# EAGLE schematic shema.v6 (EAGLE 7.6.0)
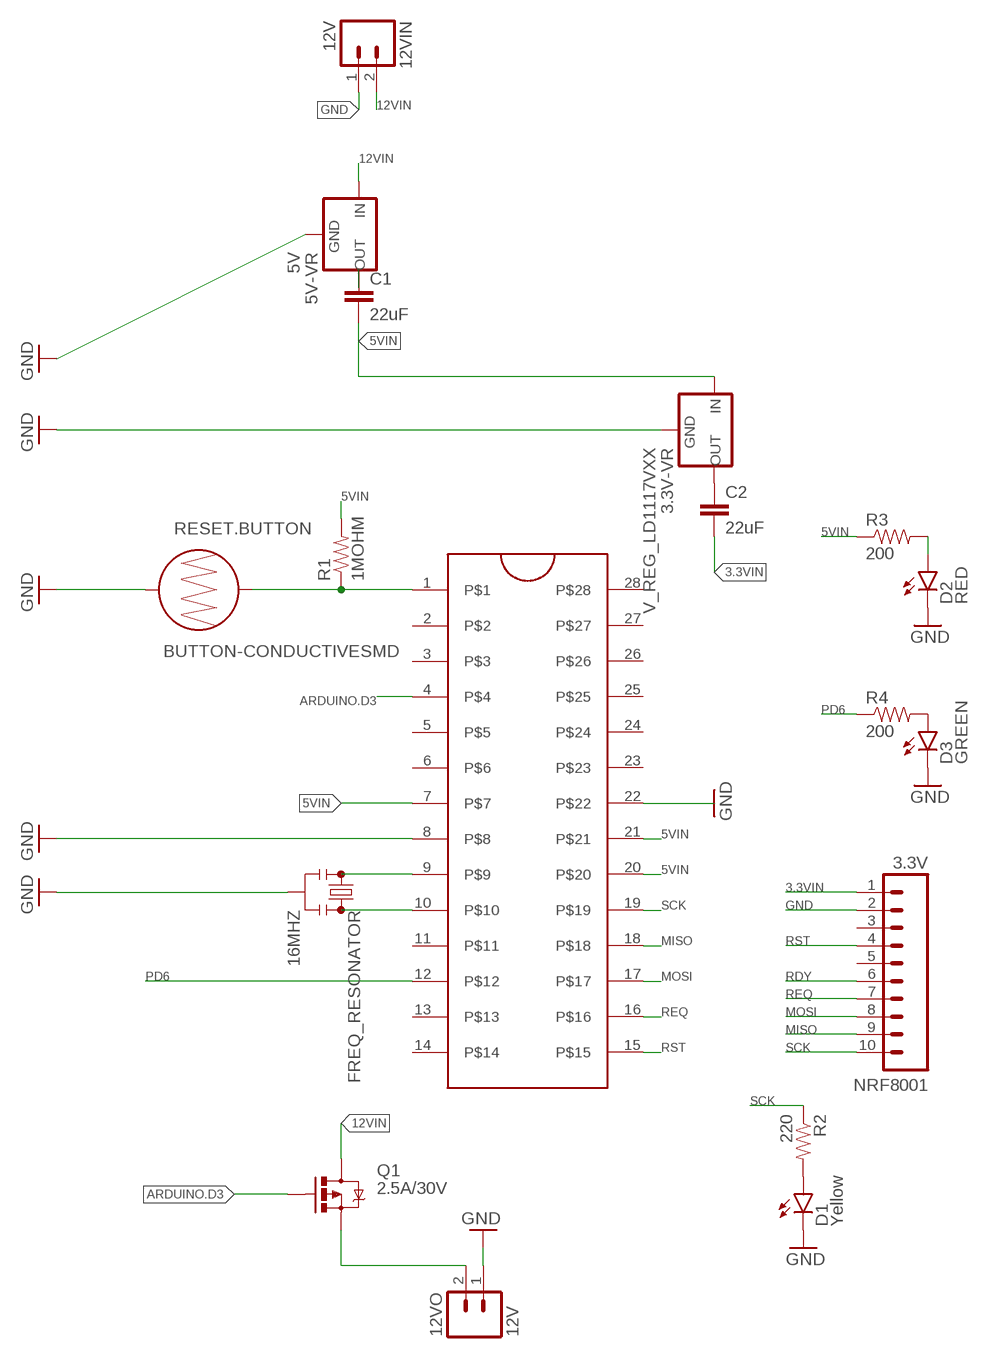
[diagram p0: schematic, sheet 1]

## Parts
3.3V-VR  V_REG_LD1117VXX  [78XXL]
5V-VR  5V  V_REG_78XX-TO-220  [TO-220-ALT]
12VIN  12V  M02JST-PTH-2  [JST-2-PTH]
12VO  12V  M02JST-PTH-2  [JST-2-PTH]
ATMEGA328  ZIFSOCKET-28-3ZIFFSOCKET-28-3  [DIL28-3-ZIF_SOCKET]
C1  22uF  22UF-16V-20%-(1210)  [1210]
C2  22uF  22UF-16V-20%-(1210)  [1210]
D1  Yellow  LED-YELLOW0603  [LED-0603]
D2  RED  LED-RED0603  [LED-0603]
D3  GREEN  LED-GREEN1206  [LED-1206]
FREQ_RESONATOR  16MHZ  RESONATOR16MHZ  [RESONATOR-SMD]
NRF8001  3.3V  M10SILK_FEMALE_PTH  [1X10]
Q1  2.5A/30V  MOSFET-PCHANNELDMG2307L  [SOT23-3]
R1  1MOHM  RESISTORPTH-1/6W  [1/6W-RES]
R2  220  100OHM-1/4W-1%(PTH)HORIZ-KIT  [AXIAL-0.3EZ]
R3  200  200OHM1/10W1%(0603)  [0603-RES]
R4  200  200OHM1/10W1%(0603)  [0603-RES]
RESET.BUTTON  BUTTON-CONDUCTIVESMD  [BUTTON-CONDUCTIVE]

## Nets
3.3VIN: C2.2 NRF8001.1
5VIN: 3.3V-VR.OUT(IN) ATMEGA328.7 ATMEGA328.20 ATMEGA328.21 C1.2 R1.2 R3.1
12VIN: 5V-VR.IN 12VIN.2 Q1.3(D)
ARDUINO.D3: ATMEGA328.4 Q1.1(G)
GND: 3.3V-VR.IN(GND) 5V-VR.GND 12VIN.1 12VO.1 ATMEGA328.8 D1.C D2.C D3.C FREQ_RESONATOR.2 NRF8001.2 RESET.BUTTON.1
MISO: ATMEGA328.18 NRF8001.9
MOSI: ATMEGA328.17 NRF8001.8
N$1: ATMEGA328.9 FREQ_RESONATOR.1
N$2: ATMEGA328.10 FREQ_RESONATOR.3
N$3: ATMEGA328.1 R1.1 RESET.BUTTON.2
N$4: 12VO.2 Q1.2(S)
N$5: 5V-VR.OUT C1.1
N$6: 3.3V-VR.GND(OUT) C2.1
N$7: D1.A R2.P$2
N$8: D2.A R3.2
N$9: ATMEGA328.22
N$10: D3.A R4.2
PD6: ATMEGA328.12 R4.1
RDY: NRF8001.6
REQ: ATMEGA328.16 NRF8001.7
RST: ATMEGA328.15 NRF8001.4
SCK: ATMEGA328.19 NRF8001.10 R2.P$1
Unconnected: ATMEGA328.2 ATMEGA328.3 ATMEGA328.5 ATMEGA328.6 ATMEGA328.11 ATMEGA328.13 ATMEGA328.14 ATMEGA328.23 ATMEGA328.24 ATMEGA328.25 ATMEGA328.26 ATMEGA328.27 ATMEGA328.28 NRF8001.3 NRF8001.5

## Library data of the parts
3.3V-VR = SparkFun-PowerIC:V_REG_LD1117VXX: LD1117VXX voltage regulator. We carry the 3.3V version (COM-00526) in TO-220 package.
5V-VR = SparkFun-PowerIC:V_REG_78XX: Voltage Regulator Standard 78xx regulator. IGO (Input Ground Output). Spark Fun Electronics SKU : COM-00107; PROD_ID: VREG-08450; SF_ID: COM-00107
12VIN 12VO = SparkFun-Connectors:M02: Standard 2-pin 0.1" header. Use with - straight break away headers ( PRT-00116) - right angle break away headers (PRT-00553) - swiss pins (PRT-00743) - machine pins (PRT-00117) - female headers (PRT-00115) Molex polarized connector foot print use with: PRT-08233 with associated crimp pins and housings. 2.54_SCREWTERM for use with PRT-10571. 3.5mm Screw Terminal footprints for PRT-08084 5mm Screw Terminal footprints for use with PRT-08432; PROD_ID: CONN-09863; SKU: PRT-09914
ATMEGA328 = SparkFun-Connectors:ZIFSOCKET-28-3: Lever-action ZIF socket for 28-pin ICs
C1 C2 = SparkFun-Capacitors:22UF-16V-20%-(1210): CAP-10381; PROD_ID: CAP-10381
D1 = SparkFun-LED:LED-YELLOW: Yellow SMD LEDs LilyPad 1206- DIO-09909 0603- DIO-09003 "SMART" means more efficient and expensive; PROD_ID: DIO-09003
D2 = SparkFun-LED:LED-RED: Assorted Red LEDs LilyPad 1206- DIO-09912 1206- DIO-00809 0603- DIO-00819 "SMART" means more efficient and expensive; PROD_ID: DIO-00819
D3 = SparkFun-LED:LED-GREEN: Various green LEDs Green LEDs used in SFE Production 0603- DIO-00821 LARGE- DIO-00862 LILYPAD- DIO-09910; PROD_ID: DIO-00862
FREQ_RESONATOR = SparkFun-FreqCtrl:RESONATOR: Resonator Small SMD resonator. Used, eg, on the Arduino Pro/ Pro Mini boards. 8MHz- XTAL-08895 16MHz- XTAL-08900; PROD_ID: XTAL-08900
NRF8001 = SparkFun-Connectors:M10: Header 10 Standard 10-pin 0.1" header. Use with straight break away headers (SKU : PRT-00116), right angle break away headers (PRT-00553), swiss pins (PRT-00743), machine pins (PRT-00117), and female headers (PRT-00115).; PROD_ID: CONN-11563
Q1 = SparkFun-DiscreteSemi:MOSFET-PCHANNEL: Generic PMOSFET IRLML2244 - TRANS-11153 (SOT-23 -20V -4.3A) (1.Gate 2.Source 3.Drain) FQP27P06 - COM-10349 <http://www.sparkfun.com/products/10349> (TO-220 -60V -27A) (1.Gate 2.Source 3.Drain); PROD_ID: TRANS-11308
R1 = SparkFun-Resistors:RESISTOR: Resistor Basic schematic elements and footprints for 0603, 1206, and PTH resistors.
R2 = SparkFun-Resistors:100OHM-1/4W-1%(PTH): RES-12181; PROD_ID: RES-12181; VALUE: 100
R3 R4 = SparkFun-Resistors:200OHM1/10W1%(0603): RES-08220; PROD_ID: RES-08220
RESET.BUTTON = SparkFun-Electromechanical:BUTTON-CONDUCTIVE: Used with rubber key pads. This one was designed and proven to work with the PolyCase Key FOB enclosures.